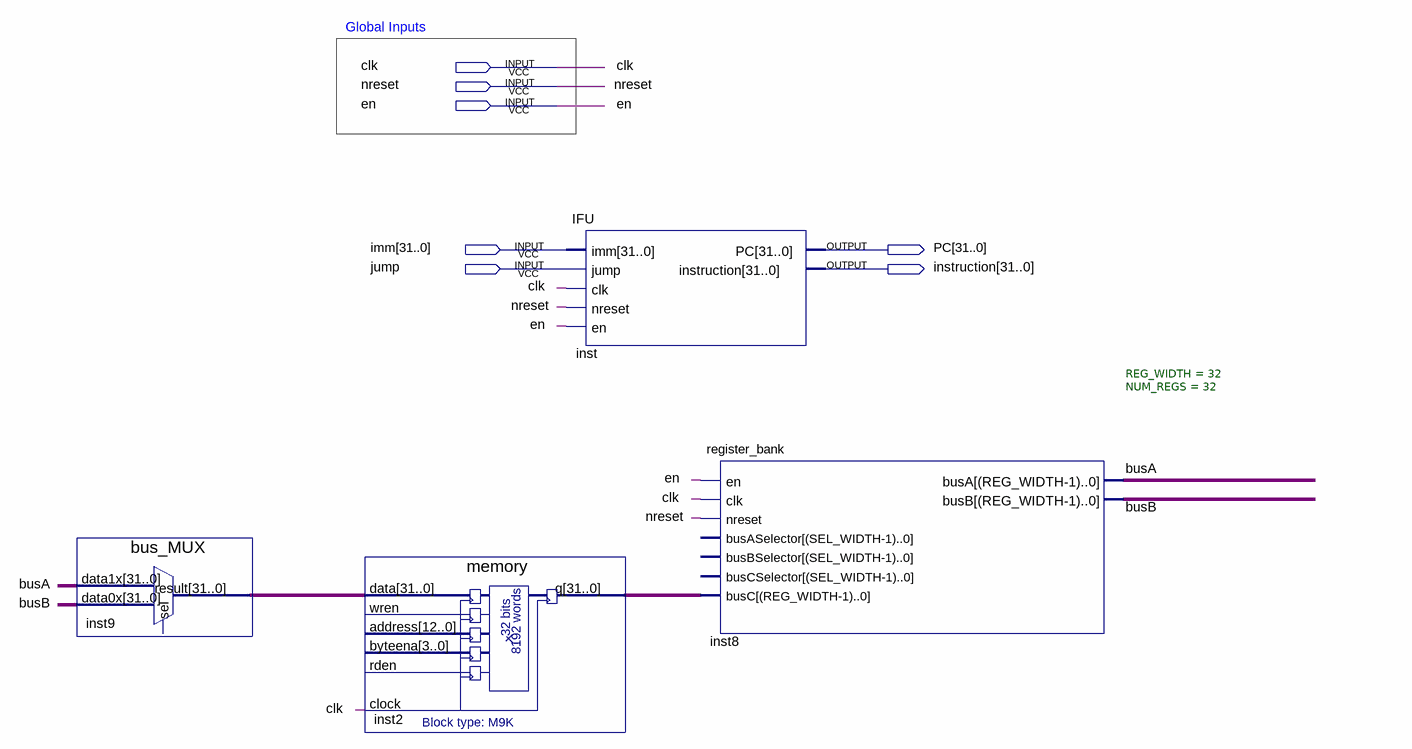
[diagram p0: schematic sheet]
// Quartus schematic ERV25.bdf as structural Verilog: 4 symbols, 7 pins
module ERV25 (
  input  clk,
  input  nreset,
  input  en,
  input  [31:0] imm,
  input  jump,
  output [31:0] PC,
  output [31:0] instruction
);

  wire busA, busB;
  wire [31:0] inst2_q, inst9_result;

  bus_MUX inst9 (.data1x({32{busA}}), .data0x({32{busB}}), .result(inst9_result));  // open: sel
  memory inst2 (.data(inst9_result), .clock(clk), .q(inst2_q));  // open: wren, address, byteena, rden
  IFU inst (.imm(imm), .jump(jump), .clk(clk), .nreset(nreset), .en(en), .PC(PC), .instruction(instruction));
  register_bank #(.REG_WIDTH(32), .NUM_REGS(32)) inst8 (
    .en(en), .clk(clk), .nreset(nreset), .busC(inst2_q), .busA(busA), .busB(busB));  // open: busASelector, busBSelector, busCSelector

  // Notes on the sheet:
  //   Global Inputs
endmodule
